# EAGLE design apple_all_pt3 (EAGLE 9.6.1)
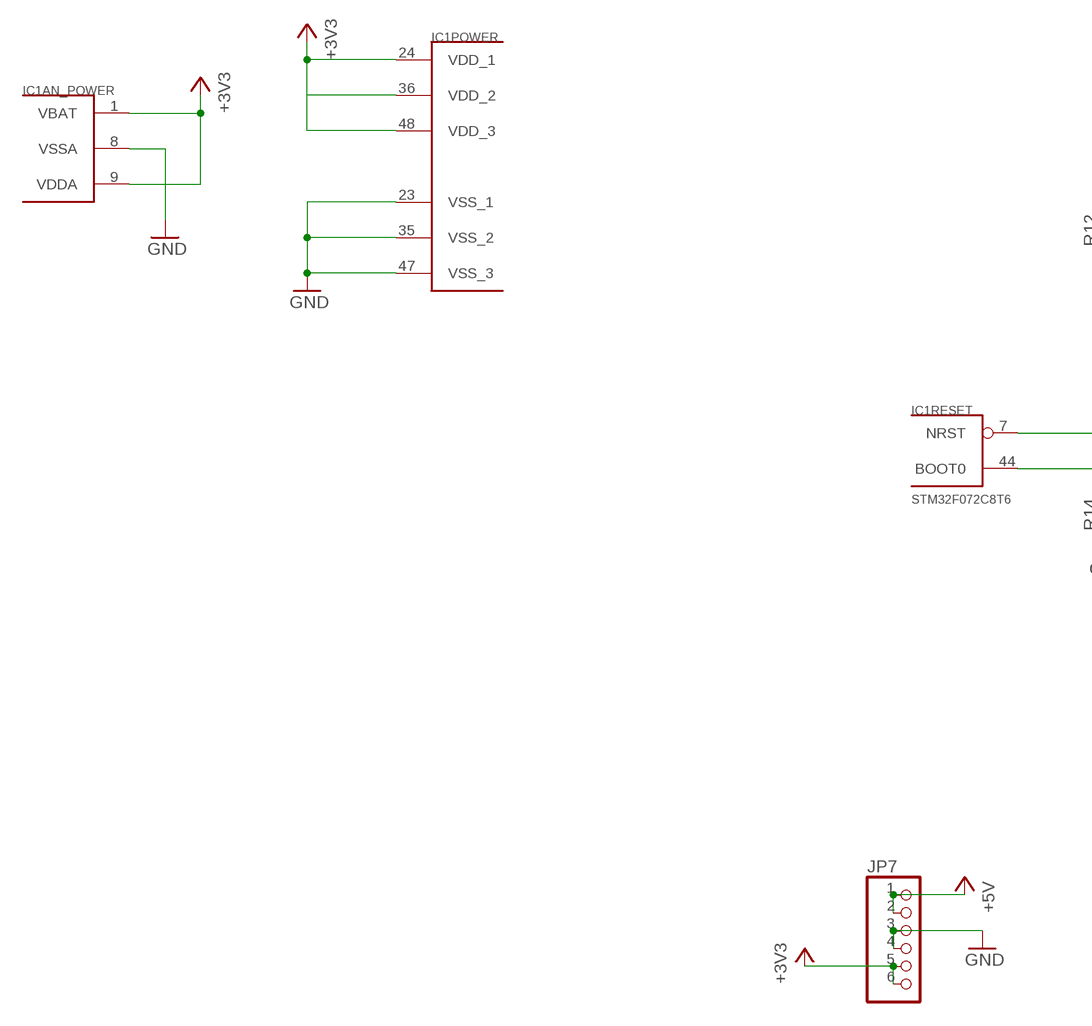
[diagram p0: schematic, sheet 1, part 1 of 2]
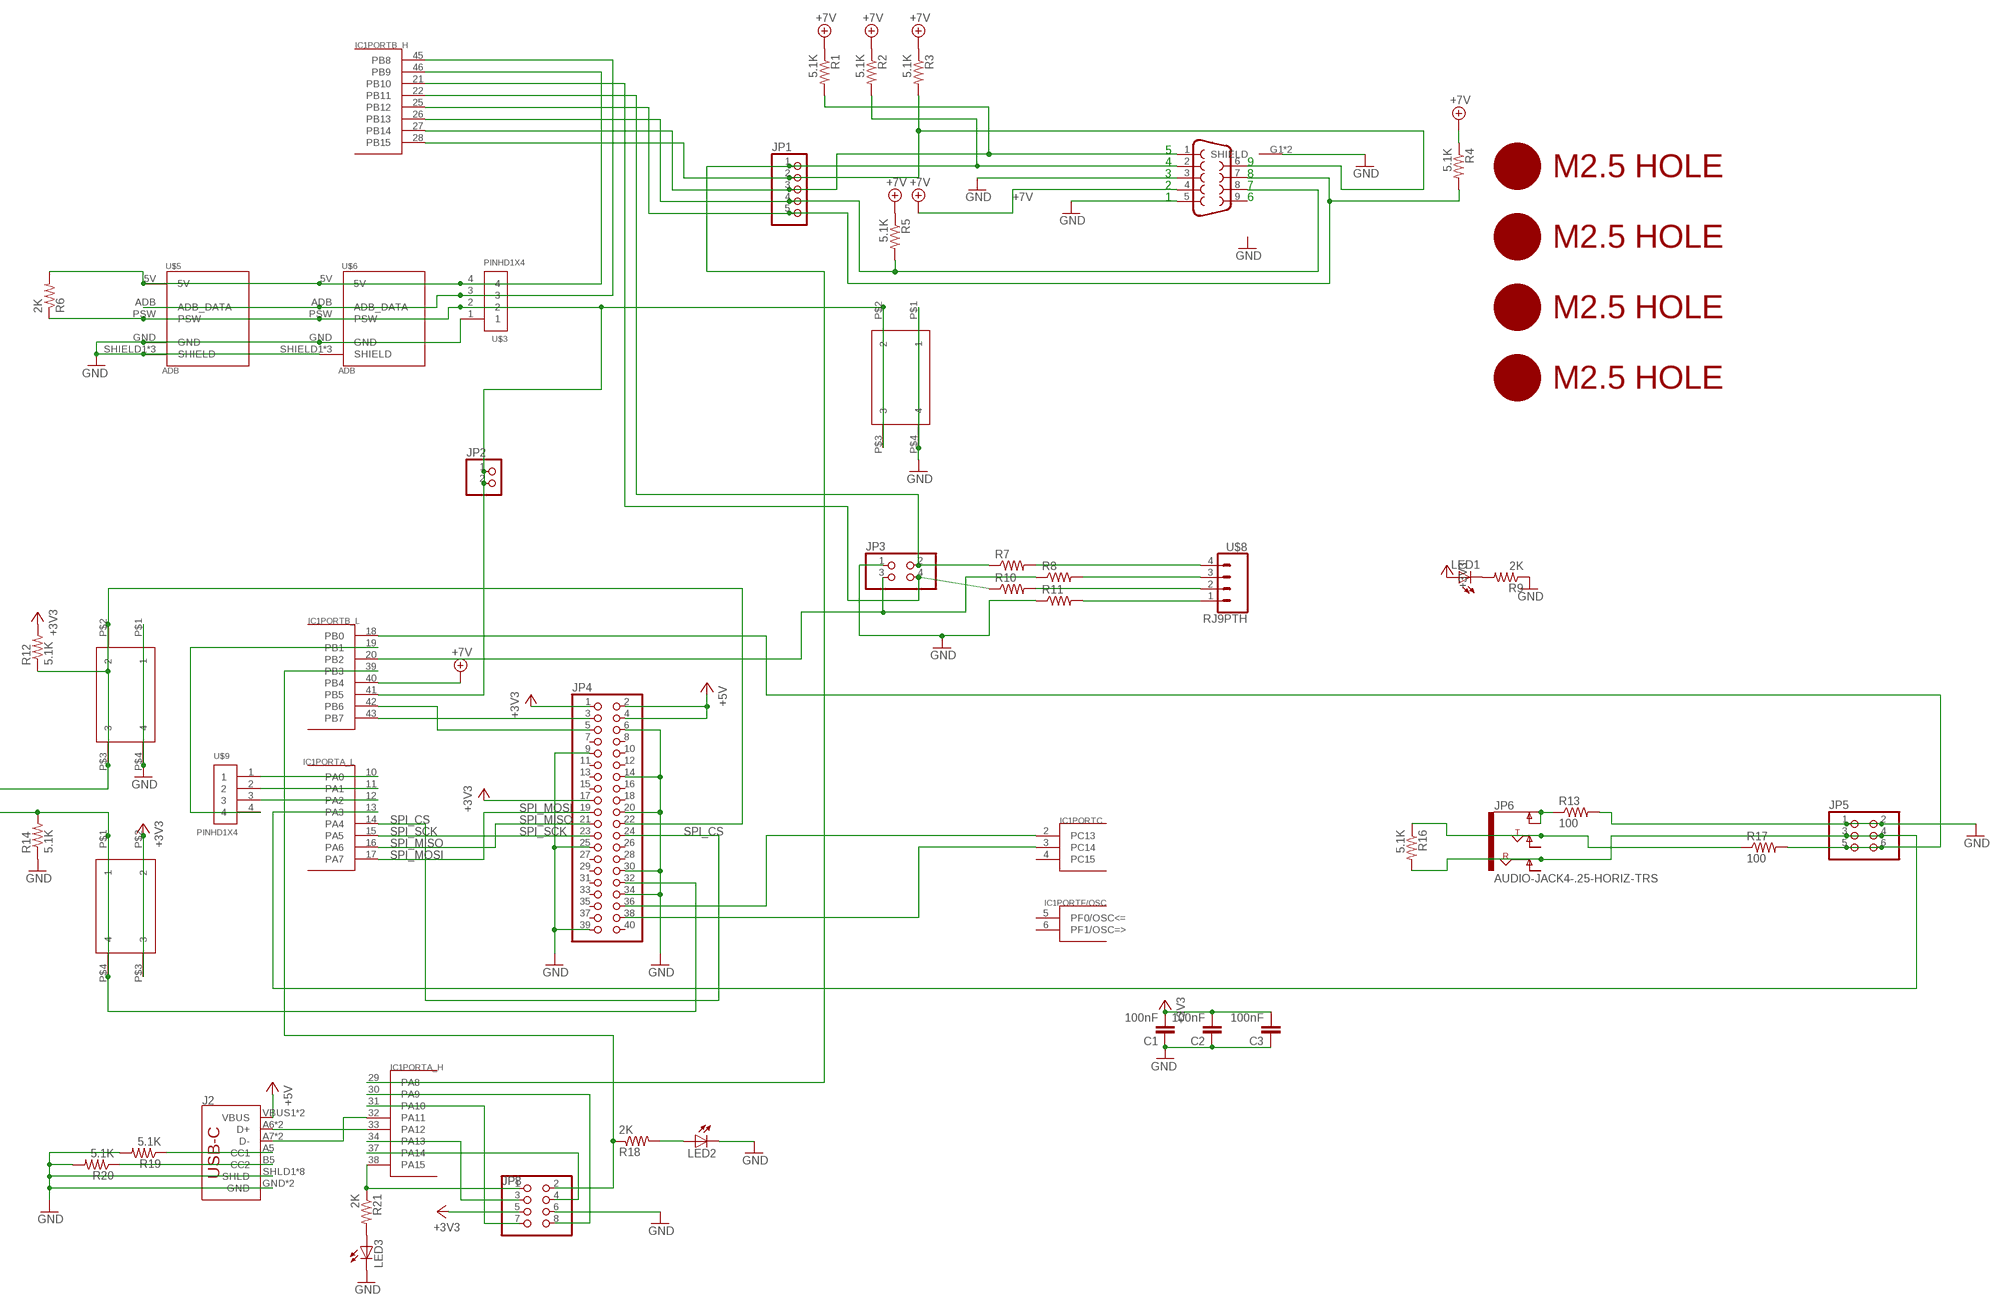
[diagram p1: schematic, sheet 1, part 2 of 2]

## Parts
C1  100nF  CAP0805  [0805@1]
C2  100nF  CAP0805  [0805@1]
C3  100nF  CAP0805  [0805@1]
IC1  STM32F072C8T6  [TQFP48]
J1  DB9FEMALE  [DB9]
J2  USB_C16PIN  [USB-C-16P]
JP1  PINHD-1X5  [1X05]
JP2  PINHD-1X2  [1X02]
JP3  PINHD-2X2  [2X02]
JP4  PINHD-2X20-BIG  [2X20-BIG]
JP5  PINHD-2X3  [2X03]
JP6  AUDIO-JACK4-.25-HORIZ-TRS  [AUDIO-JACK-.25-INCH-HORIZ-PTH]
JP7  PINHD-1X6CB  [1X06-CLEANBIG]
JP8  PINHD-2X4  [2X04]
LED1  LEDCHIP-LED0805  [CHIP-LED0805]
LED2  LEDCHIP-LED0805  [CHIP-LED0805]
LED3  LEDCHIP-LED0805  [CHIP-LED0805]
R1  5.1K  RESISTOR0805-RES  [0805]
R2  5.1K  RESISTOR0805-RES  [0805]
R3  5.1K  RESISTOR0805-RES  [0805]
R4  5.1K  RESISTOR0805-RES  [0805]
R5  5.1K  RESISTOR0805-RES  [0805]
R6  2K  RESISTOR0805-RES  [0805]
R7  200  RESISTOR0805-RES  [0805]
R8  200  RESISTOR0805-RES  [0805]
R9  2K  RESISTOR0805-RES  [0805]
R10  200  RESISTOR0805-RES  [0805]
R11  200  RESISTOR0805-RES  [0805]
R12  5.1K  RESISTOR0805-RES  [0805]
R13  100  RESISTOR0805-RES  [0805]
R14  5.1K  RESISTOR0805-RES  [0805]
R16  5.1K  RESISTOR0805-RES  [0805]
R17  100  RESISTOR0805-RES  [0805]
R18  2K  RESISTOR0805-RES  [0805]
R19  5.1K  RESISTOR0805-RES  [0805]
R20  5.1K  RESISTOR0805-RES  [0805]
R21  2K  RESISTOR0805-RES  [0805]
SW1  324_SW  [342_SWICH_FOOT]
SW2  324_SW  [342_SWICH_FOOT]
SW3  324_SW  [342_SWICH_FOOT]
U$1  M2.5HOLE  [M2.5HOLE]
U$2  M2.5HOLE  [M2.5HOLE]
U$3  PINHD1X4  [1X04-CLEANBIG]
U$4  M2.5HOLE  [M2.5HOLE]
U$5  ADB  [DIN4]
U$6  ADB  [DIN4]
U$7  M2.5HOLE  [M2.5HOLE]
U$8  RJ9PTH  [RJ9]
U$9  PINHD1X4  [1X04-CLEANBIG]

## Nets
+3V3: C1.2 C2.2 C3.2 IC1.1(AN_POWER:VBAT) IC1.9(AN_POWER:VDDA) IC1.24(POWER:VDD_1) IC1.36(POWER:VDD_2) IC1.48(POWER:VDD_3) JP4.1 JP4.17 JP7.5 JP7.6 JP8.5 LED1.A R12.2 SW3.P$2 SW3.P$3
+5V: J2.VBUS1(VBUS) J2.VBUS2(VBUS) JP4.2 JP4.4 JP7.1 JP7.2
+7V: IC1.40(PORTB_L:PB4) J1.4 R1.1 R2.1 R3.1 R4.1 R5.1
GND: C1.1 C2.1 C3.1 IC1.8(AN_POWER:VSSA) IC1.23(POWER:VSS_1) IC1.35(POWER:VSS_2) IC1.47(POWER:VSS_3) J1.3 J1.5 J1.G1(SHIELD) J1.G2(SHIELD) J2.GND J2.GND2(GND) J2.SHLD1(SHLD) J2.SHLD2(SHLD) J2.SHLD3(SHLD) J2.SHLD4(SHLD) J2.SHLD5(SHLD) J2.SHLD6(SHLD) J2.SHLD7(SHLD) J2.SHLD8(SHLD) JP3.1 JP4.6 JP4.9 JP4.14 JP4.20 JP4.25 JP4.30 JP4.34 JP4.39 JP5.1 JP5.2 JP7.3 JP7.4 JP8.6 LED2.C LED3.C R9.1 R11.1 R13.2 R14.1 R19.2 R20.2 SW1.P$1 SW1.P$4 SW2.P$1 SW2.P$4 U$3.1 U$5.GND U$5.SHIELD1(SHIELD) U$5.SHIELD2(SHIELD) U$5.SHIELD3(SHIELD) U$6.GND U$6.SHIELD1(SHIELD) U$6.SHIELD2(SHIELD) U$6.SHIELD3(SHIELD)
N$1: J2.A5(CC1) R19.1
N$2: LED2.A R18.2
N$3: IC1.46(PORTB_H:PB9) R6.2 U$3.4 U$5.5V U$6.5V
N$4: IC1.26(PORTB_H:PB13) J1.8 JP1.4 R5.2
N$5: R7.2 U$8.4
N$6: IC1.39(PORTB_L:PB3) JP8.2 R18.1
N$7: J2.B5(CC2) R20.1
N$8: IC1.33(PORTA_H:PA12) J2.A6(D+) J2.B6(D+)
N$9: IC1.32(PORTA_H:PA11) J2.A7(D-) J2.B7(D-)
N$10: R8.2 U$8.3
N$11: IC1.19(PORTB_L:PB1) U$9.4
N$12: IC1.31(PORTA_H:PA10) JP8.7
N$13: IC1.7(RESET:NRST) JP4.22 R12.1 SW2.P$2 SW2.P$3
N$14: IC1.30(PORTA_H:PA9) JP8.8
N$15: IC1.34(PORTA_H:PA13) JP8.3
N$16: IC1.37(PORTA_H:PA14) JP8.4
N$17: IC1.22(PORTB_H:PB11) JP3.2 R7.1
N$18: IC1.44(RESET:BOOT0) JP4.32 R14.2 SW3.P$1 SW3.P$4
N$19: IC1.21(PORTB_H:PB10) JP3.4 R10.1
N$20: R10.2 U$8.2
N$21: R11.2 U$8.1
N$22: IC1.42(PORTB_L:PB6) JP4.5
N$23: IC1.43(PORTB_L:PB7) JP4.3
N$24: JP6.SLEEVE(EARTH) JP6.SLEEVE-NORM(EARTH-NORM) R13.1
N$25: IC1.20(PORTB_L:PB2) JP3.3 R8.1
N$26: IC1.27(PORTB_H:PB14) J1.1 JP1.3 R1.2
N$27: IC1.38(PORTA_H:PA15) JP8.1 R21.1
N$28: LED3.A R21.2
N$29: LED1.C R9.2
N$30: IC1.13(PORTA_L:PA3) JP5.3 JP5.4 JP6.RING R16.2
N$31: IC1.18(PORTB_L:PB0) JP5.5 JP5.6 R17.2
N$32: JP6.TIP R16.1 R17.1
N$33: IC1.3(PORTC:PC14) JP4.38
N$34: IC1.28(PORTB_H:PB15) J1.6 JP1.2 R3.2
N$35: IC1.25(PORTB_H:PB12) J1.7 JP1.5 R4.2
N$36: IC1.29(PORTA_H:PA8) J1.2 JP1.1 R2.2
N$37: IC1.2(PORTC:PC13) JP4.36
N$38: IC1.10(PORTA_L:PA0) U$9.1
N$39: IC1.11(PORTA_L:PA1) U$9.2
N$40: IC1.12(PORTA_L:PA2) U$9.3
N$43: IC1.45(PORTB_H:PB8) U$3.3 U$5.ADB(ADB_DATA) U$6.ADB(ADB_DATA)
N$46: IC1.41(PORTB_L:PB5) JP2.1 JP2.2 R6.1 SW1.P$2 SW1.P$3 U$3.2 U$5.PSW U$6.PSW
SPI_CS: IC1.14(PORTA_L:PA4) JP4.24
SPI_MISO: IC1.16(PORTA_L:PA6) JP4.21
SPI_MOSI: IC1.17(PORTA_L:PA7) JP4.19
SPI_SCK: IC1.15(PORTA_L:PA5) JP4.23
Unconnected: IC1.4(PORTC:PC15) IC1.5(PORTF/OSC:PF0/OSC<=) IC1.6(PORTF/OSC:PF1/OSC=>) J1.9 JP4.7 JP4.8 JP4.10 JP4.11 JP4.12 JP4.13 JP4.15 JP4.16 JP4.18 JP4.26 JP4.27 JP4.28 JP4.29 JP4.31 JP4.33 JP4.35 JP4.37 JP4.40 JP6.RING-NORM JP6.TIP-NORM

## Notes on the sheet
- 5
- 4 | 9
- 3 | 8
- 2 | 7
- 1 | 6

## Library data of the parts
C1-C3 = clock:CAP: Capacitor Standard 0603 ceramic capacitor, and 0.1" leaded capacitor.
IC1 = clock:STM32F072C8T6: ST STM32F072 48pin LQFP
J1 = SparkFun-Connectors:DB9: DB9 Connector Standard DB9 (D-Sub 9) serial connector. Can be used for CAN bus as well as RS485 and RS232. Footprint production proven. Here is the female version connector we sell at SparkFun: 9 Pin Female Serial Connector - PCB Mount <https://www.sparkfun.com/products/429> (PRT-00429) This connector has been used on the following SparkFun products: SparkFun RS232 Shifter - SMD <https://www.sparkfun.com/products/449> (PRT-00449) SparkFun RS232 Shifter SMD (No DB9) <https://www.sparkfun.com/products/8780> (PRT-08780); PROD_ID: CONN-08194
J2 = SparkFun-Connectors:USB_C: USB Type C 16Pin Connector Super Speed pins not available on the 16-pin purely SMD connector so this part is best for USB 2.0 implementations. D1 and D2 are tied together enabling D+/- no matter which way the cable is plugged into the connector. The two channel configuration pins (CC1/2) are exposed. These are normally connected to ground via 5.1k resistors but can be reconfigured for high current/high power applications.; PROD_ID: CONN-14122
JP1 = pinhead:PINHD-1X5: PIN HEADER
JP2 = pinhead:PINHD-1X2: PIN HEADER
JP3 = pinhead:PINHD-2X2: PIN HEADER
JP4 = adafruit_changed:PINHD-2X20: PIN HEADER
JP5 = pinhead:PINHD-2X3: PIN HEADER
JP6 = SparkFun-Connectors:AUDIO-JACK4-.25-HORIZ-TRS: 1/4" TRS jack, horizontal Production SKU: COM-11144 Footprint unproven - datasheet and part seem to be slightly different; PROD_ID: COM-11144
JP7 = adafruit:PINHD-1X6: PIN HEADER
JP8 = pinhead:PINHD-2X4: PIN HEADER
LED1-LED3 = adafruit:LED: LED OSRAM: - CHIPLED LG R971, LG N971, LY N971, LG Q971, LY Q971, LO R971, LY R971 LH N974, LH R974 LS Q976, LO Q976, LY Q976 LO Q996 - Hyper CHIPLED LW Q18S LB Q993, LB Q99A, LB R99A - SideLED LS A670, LO A670, LY A670, LG A670, LP A670 LB A673, LV A673, LT A673, LW A673 LH A674 LY A675 LS A676, LA A676, LO A676, LY A676, LW A676 LS A679, LY A679, LG A679 - Hyper Micro SIDELED® LS Y876, LA Y876, LO Y876, LY Y876 LT Y87S - SmartLED LW L88C, LW L88S LB L89C, LB L89S, LG L890 LS L89K, LO L89K, LY L89K LS L896, LA L896, LO L896, LY L896 - TOPLED LS T670, LO T670, LY T670, LG T670, LP T670 LSG T670, LSP T670, LSY T670, LOP T670, LYG T670 LG T671, LOG T671, LSG T671 LB T673, LV T673, LT T673, LW T673 LH T674 LS T676, LA T676, LO T676, LY T676, LB T676, LH T676, LSB T676, LW T676 LB T67C, LV T67C, LT T67C, LS T67K, LO T67K, LY T67K, LW E67C LS E67B, LA E67B, LO E67B, LY E67B, LB E67C, LV E67C, LT E67C LW T67C LS T679, LY T679, LG T679 LS T770, LO T770, LY T770, LG T770, LP T770 LB T773, LV T773, LT T773, LW T773 LH T774 LS E675, LA E675, LY E675, LS T675 LS T776, LA T776, LO T776, LY T776, LB T776 LHGB T686 LT T68C, LB T68C - Hyper Mini TOPLED® LB M676 - Mini TOPLED Santana® LG M470 LS M47K, LO M47K, LY M47K Source: http://www.osram.convergy.de/
R1-R14 R16-R21 = SparkFun-Passives:RESISTOR: Resistor Basic schematic elements and footprints for 0603, 1206, and PTH resistors.
SW1-SW3 = 3pos_slide_switch_centered:324_SW
U$1 U$2 U$4 U$7 = f1c100s:M2.5HOLE
U$3 U$9 = adafruit_changed:PINHD1X4
U$5 U$6 = adb:ADB
U$8 = SparkFun-Retired:RJ9: This is a 4-pin connector commonly found on phone handsets. Great for simple TX/RX/PWR/GND connections. Sometime referred to as RJ9 or 4P4C. SparkFun does not currently use this on any active designs, and the connector alone has been retired. However, for more info visit here: https://www.sparkfun.com/products/retired/8694

## Net classes
1 power: width 0.178 mm

## Board
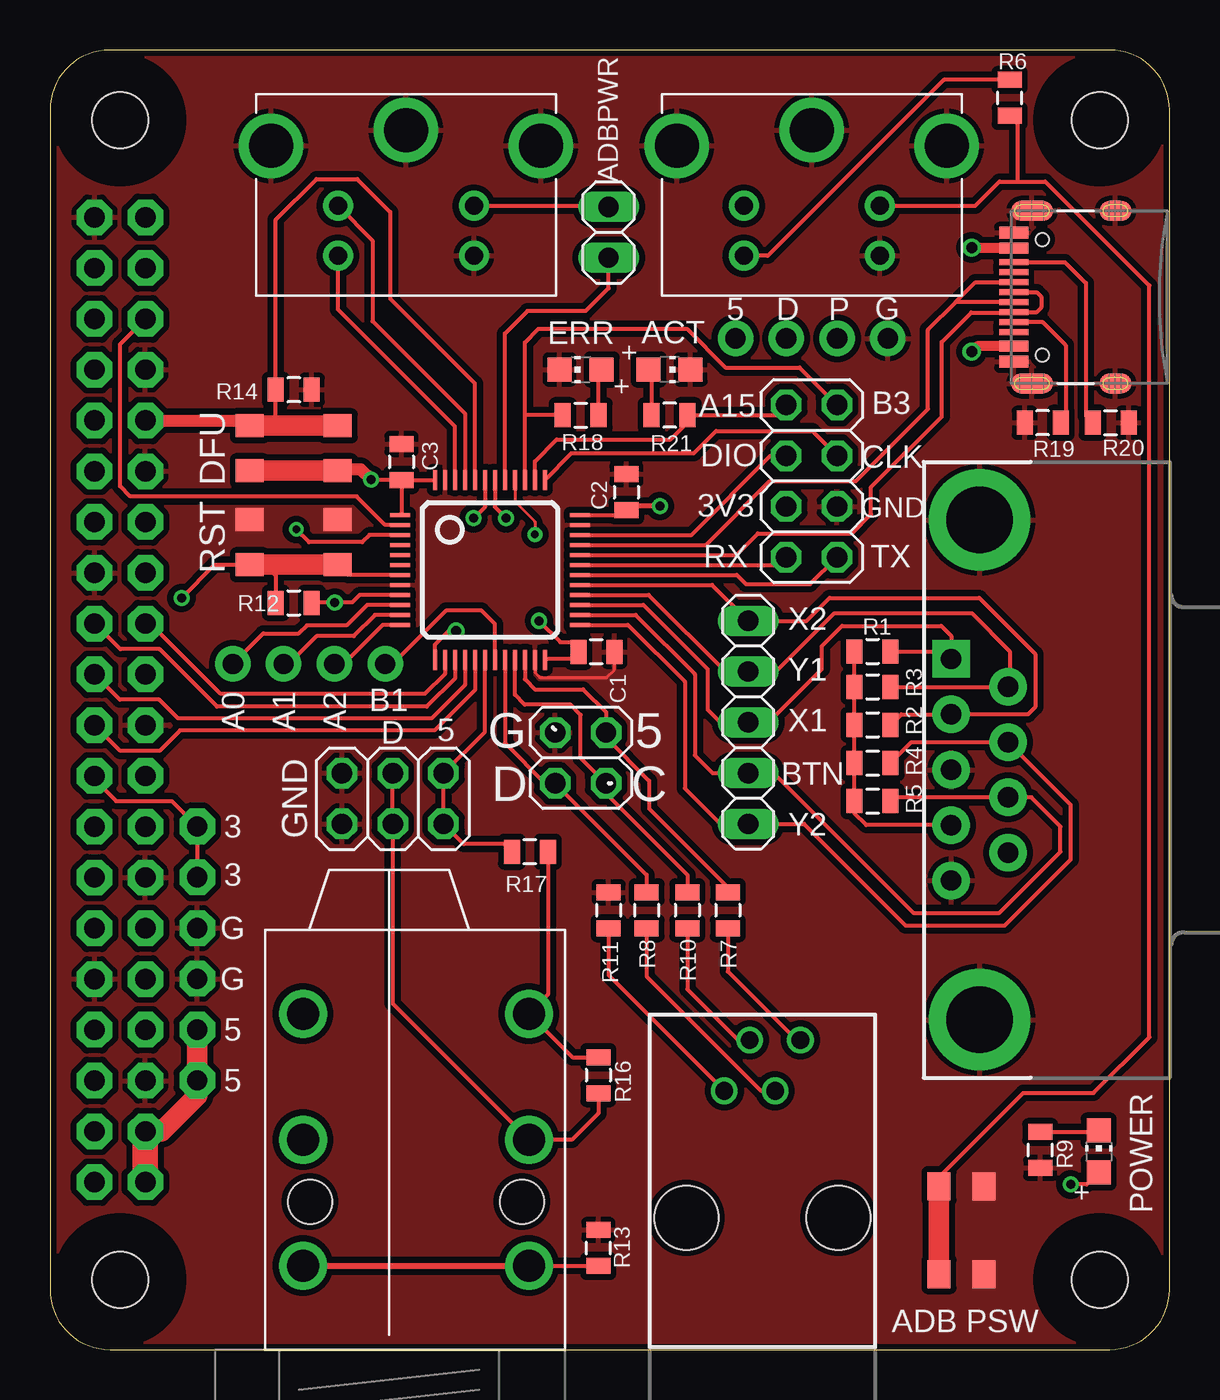
[diagram p2: board, top side]
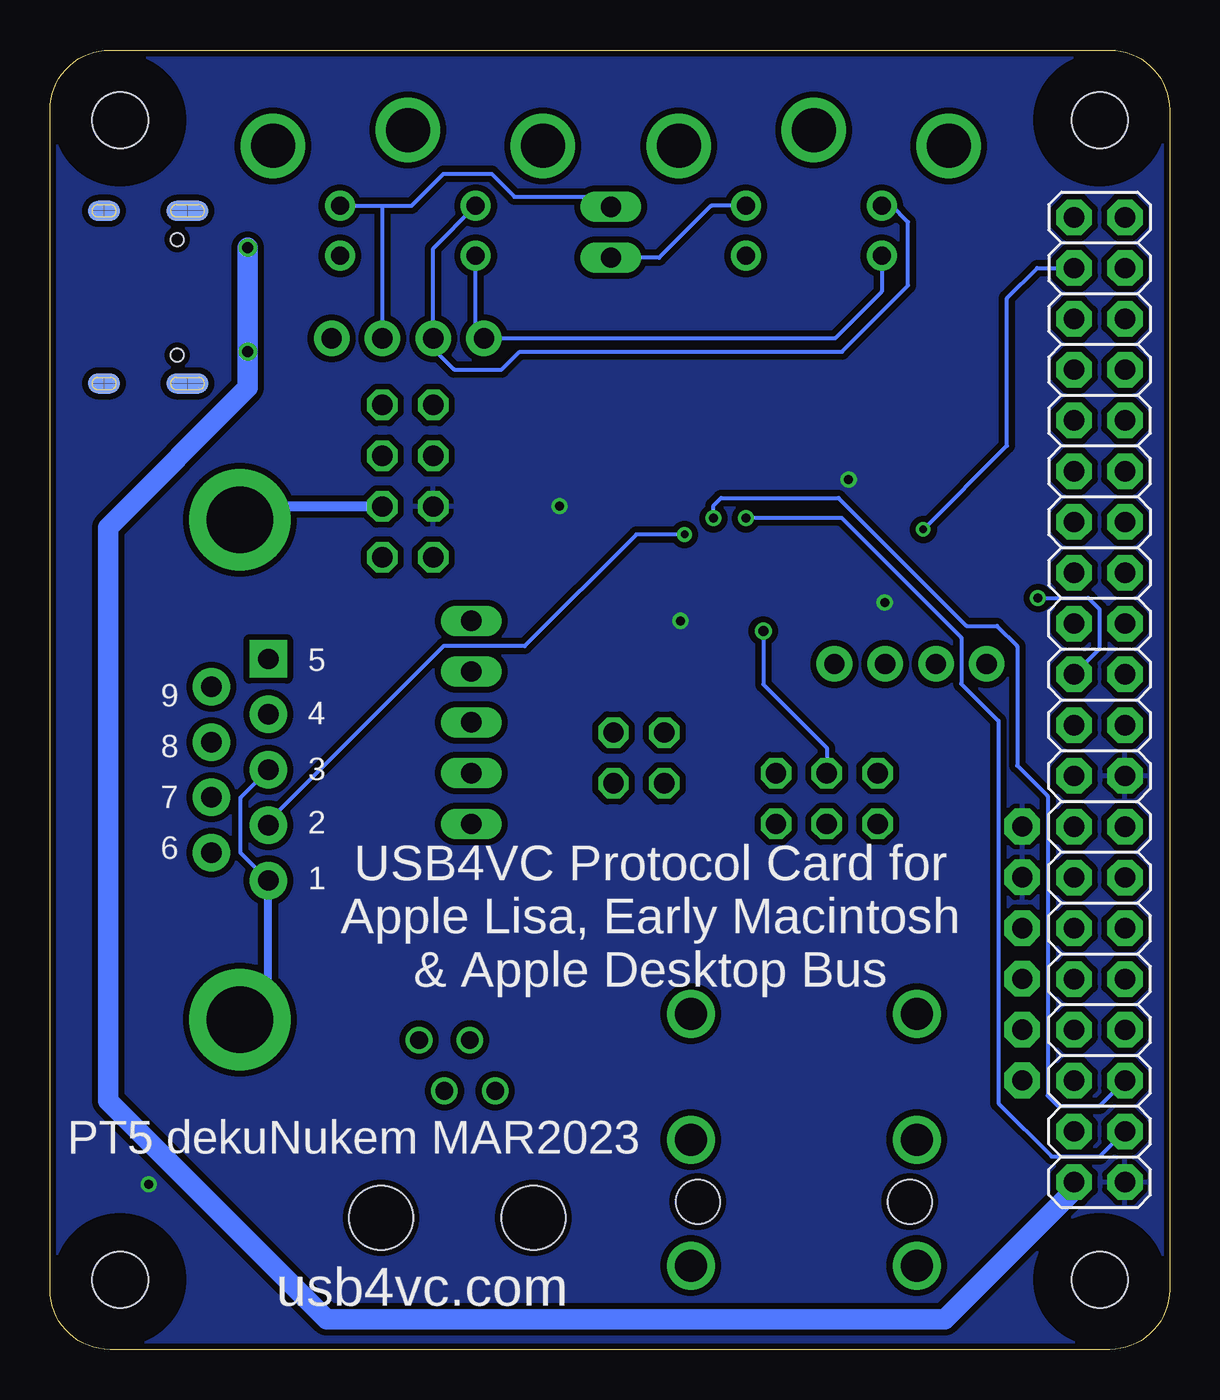
[diagram p3: board, bottom side, seen from below]

Size 56 x 65 mm. Coordinates in mm from the lower left corner, seen from the top.
Outline: 3,0 53,0 arc90 56,3 56,62 arc90 53,65 3,65 arc90 0,62 0,3 arc90 3,0
Copper layers (1*16): Top 0.035mm / dielectric 1.5mm / Bottom 0.035mm
Design rules "deku_2layer_6mil": minimum track width 6mil, minimum drill 15mil, track to track 6mil, track to pad 6mil, pad to pad 6mil, via to via 6mil, smd to smd 6mil, copper to edge 10mil, drill to drill 6mil, minimum pad ring 7mil, minimum via ring 7mil, stop-mask expansion 4mil, vias tented up to drill 25mil, thermal gap 10mil

### Footprints (pad centres in the part's own frame; a part is rotated, then mirrored left to right if it is on the bottom)
0805@1 = smd 0.8 x 1.2: 1 -0.9,0; 2 0.9,0
TQFP48 = smd 0.2 x 1: 1 -2.75,-4.5; 2 -2.25,-4.5; 3 -1.75,-4.5; 4 -1.25,-4.5; 5 -0.75,-4.5; 6 -0.25,-4.5; 7 0.25,-4.5; 8 0.75,-4.5; 9 1.25,-4.5; 10 1.75,-4.5; 11 2.25,-4.5; 12 2.75,-4.5; 25 2.75,4.5; 26 2.25,4.5; 27 1.75,4.5; 28 1.25,4.5; 29 0.75,4.5; 30 0.25,4.5; 31 -0.25,4.5; 32 -0.75,4.5; 33 -1.25,4.5; 34 -1.75,4.5; 35 -2.25,4.5; 36 -2.75,4.5 | smd 1 x 0.2: 13 4.5,-2.75; 14 4.5,-2.25; 15 4.5,-1.75; 16 4.5,-1.25; 17 4.5,-0.75; 18 4.5,-0.25; 19 4.5,0.25; 20 4.5,0.75; 21 4.5,1.25; 22 4.5,1.75; 23 4.5,2.25; 24 4.5,2.75; 37 -4.5,2.75; 38 -4.5,2.25; 39 -4.5,1.75; 40 -4.5,1.25; 41 -4.5,0.75; 42 -4.5,0.25; 43 -4.5,-0.25; 44 -4.5,-0.75; 45 -4.5,-1.25; 46 -4.5,-1.75; 47 -4.5,-2.25; 48 -4.5,-2.75
DB9 = drill 1.016 pad 1.88 square: 1 -5.54,-1.42 | drill 1.016 pad 1.88: 2 -2.77,-1.42; 3 0,-1.42; 4 2.77,-1.42; 5 5.54,-1.42; 6 -4.15,1.42; 7 -1.38,1.42; 8 1.38,1.42; 9 4.15,1.42 | drill 3.302 pad 5.08: G1 -12.5,0; G2 12.5,0
USB-C-16P = smd 0.3 x 1.45: A5 -1.25,0; A6 -0.25,0; A7 0.25,0; A8 1.25,0; B5 1.75,0; B6 0.75,0; B7 -0.75,0; B8 -1.75,0 | smd 0.6 x 1.45: GND -3.225,0; GND2 3.225,0 | smd 1 x 2.1: SHLD1 -4.32,-0.915; SHLD2 4.32,-0.915 | smd 1 x 2.1 bottom: SHLD3 -4.32,-0.915; SHLD4 4.32,-0.915 | smd 1 x 1.6: SHLD5 -4.32,-5.095; SHLD8 4.32,-5.095 | smd 1 x 1.6 bottom: SHLD6 -4.32,-5.095; SHLD7 4.32,-5.095 | smd 0.55 x 1.45: VBUS1 -2.45,0; VBUS2 2.45,0 | hole 0.65: -2.89,-1.445; 2.89,-1.445
1X05 = drill 1.016 long: 1 -5.08,0; 2 -2.54,0; 3 0,0; 4 2.54,0; 5 5.08,0
1X02 = drill 1.016 long: 1 -1.27,0; 2 1.27,0
2X02 = drill 1.016 octagon: 1 -1.27,-1.27; 2 -1.27,1.27; 3 1.27,-1.27; 4 1.27,1.27
2X20-BIG = drill 1.016 pad 1.778 octagon: 1 -24.13,-1.27; 2 -24.13,1.27; 3 -21.59,-1.27; 4 -21.59,1.27; 5 -19.05,-1.27; 6 -19.05,1.27; 7 -16.51,-1.27; 8 -16.51,1.27; 9 -13.97,-1.27; 10 -13.97,1.27; 11 -11.43,-1.27; 12 -11.43,1.27; 13 -8.89,-1.27; 14 -8.89,1.27; 15 -6.35,-1.27; 16 -6.35,1.27; 17 -3.81,-1.27; 18 -3.81,1.27; 19 -1.27,-1.27; 20 -1.27,1.27; 21 1.27,-1.27; 22 1.27,1.27; 23 3.81,-1.27; 24 3.81,1.27; 25 6.35,-1.27; 26 6.35,1.27; 27 8.89,-1.27; 28 8.89,1.27; 29 11.43,-1.27; 30 11.43,1.27; 31 13.97,-1.27; 32 13.97,1.27; 33 16.51,-1.27; 34 16.51,1.27; 35 19.05,-1.27; 36 19.05,1.27; 37 21.59,-1.27; 38 21.59,1.27; 39 24.13,-1.27; 40 24.13,1.27
2X03 = drill 1.016 octagon: 1 -2.54,-1.27; 2 -2.54,1.27; 3 0,-1.27; 4 0,1.27; 5 2.54,-1.27; 6 2.54,1.27
AUDIO-JACK-.25-INCH-HORIZ-PTH = drill 1.6: RING 10.5,-6.95; RING-NORM 10.5,4.35; SLEEVE 4.2,-6.95; SLEEVE-NORM 4.2,4.35; TIP 16.8,-6.95; TIP-NORM 16.8,4.35 | hole 2.2: 7.4,4; 7.4,-6.6
1X06-CLEANBIG = drill 1.016 pad 1.778 octagon: 1 -6.35,0; 2 -3.81,0; 3 -1.27,0; 4 1.27,0; 5 3.81,0; 6 6.35,0
2X04 = drill 1.016 octagon: 1 -3.81,-1.27; 2 -3.81,1.27; 3 -1.27,-1.27; 4 -1.27,1.27; 5 1.27,-1.27; 6 1.27,1.27; 7 3.81,-1.27; 8 3.81,1.27
CHIP-LED0805 = smd 1.2 x 1.2: A 0,-1.05; C 0,1.05
0805 = smd 0.8 x 1.2: 1 -0.9,0; 2 0.9,0
342_SWICH_FOOT = smd 1.4 x 1.15: P$1 -2.2,-1.125; P$2 -2.2,1.125; P$3 2.2,1.125; P$4 2.2,-1.125
M2.5HOLE = hole 2.8: 0,0
1X04-CLEANBIG = drill 1.016 pad 1.778: 1 -3.81,0; 2 -1.27,0; 3 1.27,0; 4 3.81,0
DIN4 = drill 0.9 pad 1.5: 5V -3.4,-6.3; ADB -3.4,-3.8; GND 3.4,-6.3; PSW 3.4,-3.8 | drill 2.2: SHIELD1 -6.75,-0.8; SHIELD2 0,0; SHIELD3 6.75,-0.8
RJ9 = drill 0.889: 1 -1.905,6.35; 2 -0.635,8.89; 3 0.635,6.35; 4 1.905,8.89 | hole 3.2: -3.81,0; 3.81,0

### Placement (x,y rotation side)
C1  27.33,34.9 180 top
C2  28.83,42.88 270 top
C3  17.58,44.4 270 top
IC1  22,39 270 top
J1  46.5,29 270 top
J2  48.2,52.63 90 top
JP1  34.92,31.37 270 top
JP2  27.94,55.88 90 top
JP3  26.54,29.59 270 top
JP4  3.5,32.5 90 bottom
JP5  17.14,27.56 0 top
JP6  17,0 90 top
JP7  7.37,19.81 90 top
JP8  38.1,43.43 270 top
LED1  52.45,9.91 0 top
LED2  26.54,49.02 90 top
LED3  30.99,49.02 270 top
R1  41.15,34.92 0 top
R2  41.15,31.24 0 top
R3  41.15,33.15 0 top
R4  41.15,29.34 0 top
R5  41.15,27.43 0 top
R6  48.01,62.61 90 top
R7  33.91,21.97 270 top
R8  29.84,21.97 270 top
R9  49.53,9.98 90 top
R10  31.88,21.97 270 top
R11  27.94,21.97 270 top
R12  12.19,37.34 0 top
R13  27.43,5.08 90 top
R14  12.19,48.01 180 top
R16  27.43,13.72 270 top
R17  24,24.89 180 top
R18  26.54,46.74 0 top
R19  49.66,46.35 180 top
R20  53.06,46.35 0 top
R21  30.99,46.74 180 top
SW1  45.59,5.97 90 top
SW2  12.19,40.39 180 top
SW3  12.19,45.09 180 top
U$1  3.5,3.5 0 top
U$2  52.5,3.5 0 top
U$3  38.1,50.57 180 top
U$4  3.5,61.5 0 top
U$5  17.8,61 0 top
U$6  38.1,61 0 top
U$7  52.5,61.5 0 top
U$8  35.63,6.59 0 top
U$9  12.95,34.29 0 top

### Tracks (layer width: path | path; a pad name or v marks a point on that pad's centre or on a via)
+3V3  (via drill 0.45)
  Top 0.203: v16.05,43.51 17.57,43.51 C3.2 | C3.2 IC1.48 | C3.2 17.58,41.83 IC1.1 | R12.2 13.12,37.36 v14.25,37.36 15.11,37.36 15.5,37.75 IC1.9 | IC1.36 28.63,41.75 28.84,41.96 29.07,42.19 | v24.46,36.45 25.53,35.38 26.38,35.38 26.43,35.33 C1.2 26.43,34.77 26.18,34.52 24.77,34.52 IC1.24 | JP4.17 2.23,28.5 3.3,27.43 6.1,27.43 JP7.6 JP7.5 | LED1.A 51.85,8.26 v51.05,8.26
  Top 0.254: v30.5,42.19 29.07,42.19 | 28.84,41.96 C2.2
  Top 0.61: v16.05,43.51 15.54,44.02 14.45,44.02 SW3.P$2
  Top 1.016: SW3.P$3 SW3.P$2
  pour Bottom (isolate 0.305, rank 2): 0,3 0,62 arc-90 3,65 53,65 arc-90 56,62 56,3 arc-90 53,0 3,0 arc-90
+5V  (via drill 0.55)
  Top 0.508: J2.VBUS2 46.13,55.09 v46.1,55.12 | J2.VBUS1 46.38,50.19 v46.1,49.91
  Top 1.016: JP4.4 5.58,10.91 7.37,12.7 JP7.1 JP7.2
  Top 1.27: JP4.4 JP4.2
  Bottom 1.016: v46.1,55.12 v46.1,49.91 46.1,48.11 53.09,41.12 53.09,12.45 42.16,1.52 11.23,1.52 4.77,7.99 JP4.2
+7V  (via drill 0.38)
  Top 0.152: IC1.40 23.25,42.41 24.26,41.4 v24.26,40.77
  Top 0.203: R1.1 R3.1 R2.1 R4.1 R5.1 40.25,26.81 40.83,26.23 J1.4
  Bottom 0.203: v24.26,40.77 26.67,40.77 32.26,35.18 36.32,35.18 45.08,26.42 J1.4
GND
  Top 0.152: IC1.23 24.25,33.87 24.51,33.6 27.84,33.6 28.23,34 C1.1
  Bottom 0.203: J1.3 46.48,27.6 46.48,24.86 J1.5
  Bottom 0.406: J1.G2 45.08,17.92 J1.5
  Bottom 0.508: JP8.6 45.84,42.16 J1.G1
  pour Top (isolate 0.305): 3,0 53,0 arc90 56,3 56,62 arc90 53,65 3,65 arc90 0,62 0,3 arc90
N$1
  Top 0.203: R19.1 50.81,46.61 50.81,50.23 49.66,51.38 J2.A5
N$2
  Top 0.203: R18.2 27.44,48.87 LED2.A
N$3
  Top 0.203: IC1.46 20.25,46.17 14.4,52.02 U$5.5V | R6.2 44.72,63.51 35.9,54.7 U$6.5V
  Bottom 0.203: U$5.5V 14.4,52.92 16.75,50.58 U$3.4 34.7,50.98 U$6.5V
N$4
  Top 0.203: IC1.26 29.29,36.75 32.26,33.78 32.26,29.72 33.15,28.83 JP1.4 36.2,28.83 43.18,21.84 47.5,21.84 50.55,24.89 50.55,26.16 49.09,27.62 J1.8 42.24,27.62 R5.2
N$5
  Top 0.203: R7.2 33.91,18.91 37.34,15.48 U$8.4
N$6
  Top 0.203: JP8.2 37.49,49.12 33.78,49.12 31.85,51.05 24.43,51.05 23.75,50.37 23.75,46.74 | IC1.39 23.75,46.74 | R18.1 23.75,46.74
N$7
  Top 0.203: J2.B5 50.77,54.38 51.82,53.34 51.82,46.7 R20.1
N$8
  Top 0.203: IC1.33 32.81,40.25 35.99,43.43 40.31,43.43 43.92,47.04 43.92,51 45.29,52.38 45.3,52.38 | J2.B6 46.3,53.38 45.3,52.38 | J2.A6 45.3,52.38
N$9
  Top 0.152: 48.22,51.87 J2.B7
  Top 0.203: IC1.32 34.34,39.75 35.41,40.82 40.11,40.82 41.07,41.78 41.07,43.13 44.6,46.66 44.6,50.39 46.08,51.87 48.22,51.87 49.33,51.87 49.58,52.12 49.58,52.65 49.35,52.88 J2.A7
N$10
  Top 0.203: R8.2 29.84,18.67 35.57,12.94 U$8.3
N$11
  Top 0.203: IC1.19 22.25,36.3 21.59,36.96 19.81,36.96 17.14,34.29 U$9.4
N$12
  Top 0.203: IC1.31 36.46,39.25 JP8.7
N$13  (via drill 0.45)
  Top 0.203: IC1.7 14.9,38.75 SW2.P$2 | 10.74,39.26 11.29,38.71 R12.1 | v6.58,37.59 8.25,39.26 SW2.P$3
  Top 1.016: SW2.P$3 10.74,39.26 SW2.P$2
  Bottom 0.203: JP4.22 3.5,35.03 3.5,37.03 4.06,37.59 v6.58,37.59
N$14
  Top 0.203: IC1.30 34.35,38.75 34.82,38.28 38.02,38.28 JP8.8
N$15
  Top 0.203: IC1.34 32.09,40.75 36.04,44.7 JP8.3
N$16
  Top 0.203: IC1.37 26.08,44.83 32.21,44.83 33.33,45.95 38.12,45.95 JP8.4
N$17
  Top 0.203: IC1.22 23.75,33.53 24.26,33.02 26.67,33.02 27.81,31.88 JP3.2 27.81,30.61 29.97,28.45 29.97,27.05 33.91,23.11 R7.1
N$18
  Top 0.203: 11.28,46.21 11.28,47.99 R14.2 11.29,56.5 13.34,58.55 15.37,58.55 17.02,56.9 17.02,52.55 21.25,48.32 IC1.44
  Top 0.61: JP4.32 9.73,46.47 SW3.P$4
  Top 1.016: SW3.P$4 11.28,46.21 SW3.P$1
N$19
  Top 0.203: R10.1 31.88,23.75 27.81,27.81 JP3.4 26.54,29.59 26.54,31.75 26.04,32.26 23.75,32.26 23.25,32.76 IC1.21
N$20
  Top 0.203: R10.2 31.88,18.02 34.42,15.48 U$8.2
N$21
  Top 0.203: R11.2 27.94,18.73 U$8.1
N$22  (via drill 0.45)
  Top 0.203: IC1.42 22.25,42.14 v22.81,41.58
  Bottom 0.203: v22.81,41.58 22.81,42.22 22.43,42.6 16.56,42.6 10.16,36.2 8.64,36.2 7.62,35.18 7.62,29.21 6.1,27.69 6.1,12.7 5.59,12.19 3.49,12.19 JP4.5
N$23  (via drill 0.45)
  Top 0.203: IC1.43 21.75,42.15 v21.18,41.58
  Bottom 0.203: v21.18,41.58 21.16,41.6 16.41,41.6 10.41,35.61 10.41,33.3 8.56,31.45 8.56,12.32 5.89,9.65 3.49,9.65 JP4.3
N$24
  Top 0.203: JP6.SLEEVE 27.41,4.2 R13.1
  Top 0.305: JP6.SLEEVE-NORM JP6.SLEEVE
N$25
  Top 0.203: R8.1 29.84,23.75 JP3.3 24.77,28.32 22.75,30.34 IC1.20
N$26
  Top 0.203: R1.2 44.7,34.92 J1.1 45.08,35.69 44.58,36.2 39.62,36.2 38.61,35.18 38.61,34.04 35.94,31.37 JP1.3 33.53,31.37 32.89,32 32.89,34.04 29.68,37.25 IC1.27
N$27
  Top 0.203: IC1.38 24.25,44.42 25.35,45.52 31.05,45.52 31.89,46.35 R21.1 36.32,46.74 JP8.1
N$28
  Top 0.203: LED3.A 30.09,48.87 R21.2
N$29
  Top 0.203: R9.2 52.38,10.88 LED1.C
N$30  (via drill 0.5)
  Top 0.203: R16.2 27.43,11.82 26.11,10.5 JP6.RING 17.14,17.3 JP5.3 JP5.4 | IC1.13 19.25,35.25 19.94,35.94 v20.32,35.94
  Bottom 0.203: v20.32,35.94 20.32,33.27 17.14,30.1 JP5.4
N$31
  Top 0.203: IC1.18 21.75,30.89 JP5.6 JP5.5 20.69,25.28 22.71,25.28 R17.2
N$32
  Top 0.203: R16.1 26.13,14.62 JP6.TIP 24.9,17.75 R17.1
N$33  (via drill 0.38)
  Top 0.203: IC1.3 15.98,40.75 15.62,40.39 12.95,40.39 v12.32,41.02
  Bottom 0.203: v12.32,41.02 8.13,45.21 8.13,52.58 6.62,54.09 JP4.38
N$34
  Top 0.203: R3.2 J1.6 48.01,33.15 48.01,34.92 46.1,36.83 39.24,36.83 36.32,33.91 JP1.2 33.78,33.91 29.94,37.75 IC1.28
N$35
  Top 0.203: R4.2 43.09,30.38 J1.7 51.05,27.25 51.05,24.51 47.75,21.21 42.8,21.21 37.72,26.29 JP1.5 33.53,26.29 31.75,28.07 31.75,33.4 28.9,36.25 IC1.25
N$36
  Top 0.203: R2.2 42.58,31.77 J1.2 48.91,31.77 49.28,32.13 49.28,34.8 46.48,37.59 38.99,37.59 37.85,36.45 JP1.1 33.12,38.25 IC1.29
N$37
  Top 0.203: IC1.2 16.76,41.25 15.34,42.67 4.01,42.67 3.5,43.18 3.5,50.28 JP4.36
N$38
  Top 0.203: IC1.10 15.86,37.25 14.83,36.22 12.85,36.22 12.45,35.81 10.67,35.81 U$9.1
N$39
  Top 0.203: IC1.11 16.25,36.75 15.19,35.69 13.34,35.69 11.94,34.29 U$9.2
N$40
  Top 0.203: IC1.12 16.64,36.25 14.68,34.29 U$9.3
N$43
  Top 0.203: IC1.45 20.75,46.81 16.13,51.44 16.13,55.47 U$5.ADB
  Bottom 0.203: U$6.ADB 36.83,55.07 U$3.3 36.83,50.07 35.78,49.02 33.4,49.02 32.51,49.91 16.38,49.91 13.08,53.21 13.08,56.39 13.89,57.2 U$5.ADB
N$46
  Top 0.203: U$6.PSW 46.28,57.2 47.5,58.42 48.39,58.42 | 48.39,58.42 49.78,58.42 54.99,53.21 54.99,15.62 52.2,12.83 48.68,12.83 44.47,8.62 SW1.P$3 | IC1.41 22.75,50.82 23.88,51.94 26.8,51.94 27.94,53.09 JP2.1 | U$5.PSW 27.89,57.2 JP2.2 | R6.1 48.39,61.33 48.39,58.42
  Top 1.016: SW1.P$2 SW1.P$3
  Bottom 0.203: U$6.PSW 39.37,57.2 | 39.37,57.2 37.92,57.2 36.32,58.8 33.91,58.8 32.77,57.66 28.45,57.66 JP2.2 | U$3.2 39.37,57.2 | U$5.PSW 22.94,57.2 25.53,54.61 JP2.1
SPI_CS
  Top 0.203: IC1.14 19.75,33.8 18.75,32.79 8.54,32.79 5.02,36.31 JP4.24
SPI_MISO
  Top 0.203: IC1.16 20.75,33.25 19.07,31.57 6.4,31.57 5.46,32.51 3.49,32.51 JP4.21
SPI_MOSI
  Top 0.203: JP4.19 3.51,29.95 5.49,29.95 6.5,30.96 19.23,30.96 21.25,32.98 IC1.17
SPI_SCK
  Top 0.203: IC1.15 20.25,33.56 18.85,32.16 8.36,32.16 5.49,35.03 3.51,35.03 JP4.23

### Text on the board
tNames: ADBPWR | 5 | D | P | G | ERR | ACT | A15 | B3 | DFU | DIO | CLK | 3V3 | GND | RST | RX | TX | X2 | Y1 | A0 | A1 | A2 | B1 | D | 5 | G | 5 | X1 | BTN | GND | D | C | 3 | Y2 | 3 | G | G | 5 | 5 | POWER | ADB PSW
bNames: 5 | 9 | 4 | 8 | 3 | 7 | 2 | 6 | 1 | USB4VC Protocol Card for / Apple Lisa, Early Macintosh / & Apple Desktop Bus | PT5 dekuNukem MAR2023 | usb4vc.com